# Altium schematic sheet Schematic.SchDoc
size A4
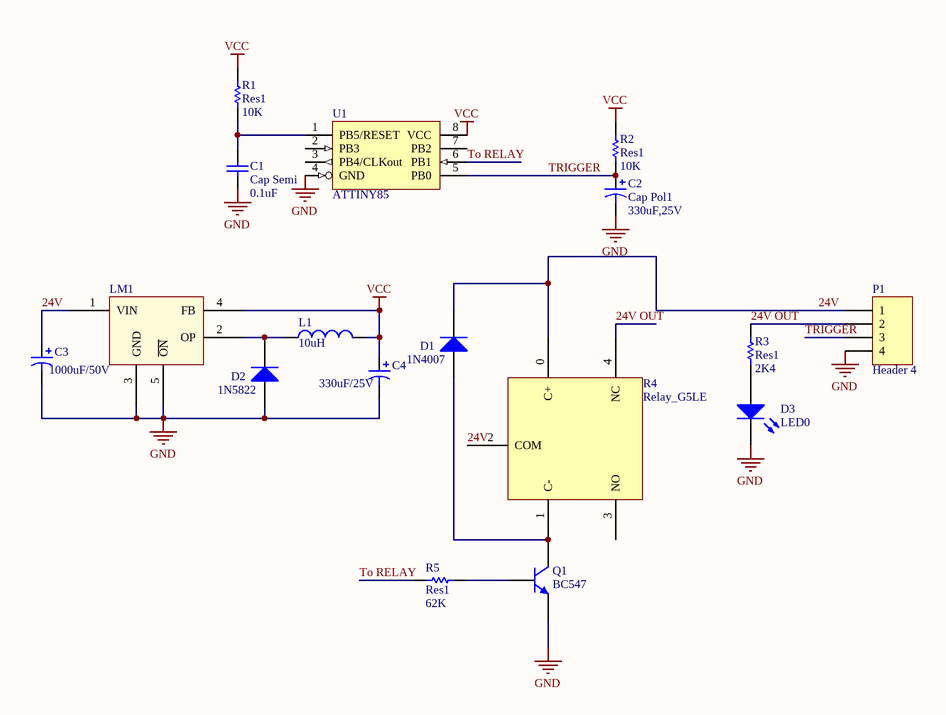
[diagram p0: Schematic.SchDoc]

## Parts
C1  Cap Semi  value 0.1uF  [C1206]
C2  Cap Pol1  value 330uF,25V  [Polar Cap 9 mm]
C3  value 1000uF/50V  [polar Cap]  (hidden comment: Cap Pol1)
C4  value 330uF/25V  [12mm]  (hidden comment: Cap Pol1)
D1  1N4007  [AXIAL-0.4]
D2  1N5822  [AXIAL-0.6]
D3  LED0  [LED]
L1  value 10uH  [WireWound]  (hidden comment: Inductor)
LM1  LM2576  [LM2576]  (value not drawn)
P1  Header 4  [HDR1X4]
Q1  BC547  [TO-92]
R1  Res1  value 10K  [1206]
R2  Res1  value 10K  [1206]
R3  Res1  value 2K4  [1206]
R4  Relay_G5LE  [G5LE_relay]
R5  Res1  value 62K  [1206]
U1  ATTINY85  [DIP8]

## Nets
GND: C1.1 C2.2 C3.2 C4.2 D2.1(A) D3.2(K) LM1.3(GND) LM1.5(~{ON}) P1.4 Q1.1(E) U1.4(GND)
VCC: C4.1 L1.2 LM1.4(FB) R1.2 R2.2 U1.8(VCC)
24V: C3.1 D1.2(K) LM1.1(VIN) P1.1 R4.0(C+) R4.2(COM)
24V OUT: P1.2 R3.2 R4.4(NC)
To RELAY: R5.2 U1.6(PB1)
TRIGGER: C2.1 P1.3 R2.1 U1.5(PB0)
NetC1_2: C1.2 R1.1 U1.1(PB5/RESET)
NetD1_1: D1.1(A) Q1.3(C) R4.1(C-)
NetD2_2: D2.2(K) L1.1 LM1.2(OP)
NetD3_1: D3.1(A) R3.1
NetQ1_2: Q1.2(B) R5.1

Not connected (* = marked no-connect by the designer): R4 3(NO); U1 2(PB3) 3(PB4/CLKout) 7(PB2)

## Library data of the parts
C1 = Cap Semi: Capacitor (Semiconductor SIM Model); Published: 8-Jun-2000; LatestRevisionDate: 29-May-2009; LatestRevisionNote: IPC-7351 Footprint Added.; PackageReference: C1206; Publisher: Altium Limited; PackageDescription: Chip Capacitor
C2-C4 = Cap Pol1: Polarized Capacitor (Radial); Published: 8-Jun-2000; LatestRevisionDate: 17-Jul-2002; LatestRevisionNote: Re-released for DXP Platform.; PackageReference: RB7.6-15; Publisher: Altium Limited; PackageDescription: Polarized Capacitor (Radial); 2 Leads
D1 D2 = Diode 1N5408: 3 Amp Medium Power Silicon Rectifier Diode; Published: 8-Jun-2000; LatestRevisionDate: 17-Jul-2002; LatestRevisionNote: Re-released for DXP Platform.; DatasheetVersion: Aug-1984; PackageReference: DO-201AD; Publisher: Altium Limited; PackageDescription: Diode, Axial; Body 9.5 x 5.3 mm (LxDia. max), Lead Dia. 1.32 mm (max); ComponentLink1Description: Manufacturer Link; ComponentLink1URL: http://www.irf.com/
D3 = LED0: Typical INFRARED GaAs LED; Published: 8-Jun-2000; LatestRevisionDate: 08-Jul-2005; LatestRevisionNote: Mech Layer 1 removed.; PackageReference: LED-0; Publisher: Altium Limited; PackageDescription: LED; 2 Leads
L1 = Inductor: Code_IEC: 1005; Published: 8-Jun-2000; LatestRevisionDate: 29-May-2009; LatestRevisionNote: IPC-7351 Footprint Added.; PackageReference: 0402-A; Publisher: Altium Limited; PackageDescription: Chip Inductor; Code_JEITA: 0402
LM1 = Component_1: Switcher
P1 = Header 4: Header, 4-Pin; LatestRevisionDate: 17-Jul-2002; LatestRevisionNote: Re-released for DXP Platform.; Publisher: Altium Limited
Q1 = 2N3904: NPN General Purpose Amplifier; Published: 8-Jun-2000; LatestRevisionDate: 15-Jan-2003; LatestRevisionNote: PCB Footprint 'BCY-W3/D4.7' replaced; DatasheetVersion: 1997; PackageVersion: Sep-1998; PackageReference: TO-92A; Publisher: Altium Limited; PackageDescription: TO, Flat Index; 3 In-Line, Axial Leads; Body Dia. 4.5mm; Leads 0.51 x 0.48 mm (max); ComponentLink1Description: Manufacturer Link; ComponentLink1URL: http://www.fairchildsemi.com/; ComponentLink2Description: Datasheet; ComponentLink2URL: http://www.fairchildsemi.com/ds/2N%2F2N3904.pdf
R1-R3 R5 = Res1: Resistor; Published: 8-Jun-2000; LatestRevisionDate: 17-Jul-2002; LatestRevisionNote: Re-released for DXP Platform.; PackageReference: AXIAL-0.3; Publisher: Altium Limited; PackageDescription: Axial Device, Thru-Hole; 2 Leads; 0.3 in Pin Spacing
U1 = NE555D: Precision Timer; Published: 16-Jan-2001; LatestRevisionDate: 13-Apr-2006; LatestRevisionNote: IPC-7351 Footprint Added.; DatasheetVersion: Feb-1992; PackageVersion: Jan-1998; PackageReference: D008; Publisher: Altium Limited; PackageDescription: 8-Pin Small Outline Integrated Circuit 1.27 mm Pitch; Code_IPC: SOIC127P600-8; ComponentLink1Description: Manufacturer Link; ComponentLink1URL: http://www.ti.com/; ComponentLink2Description: Datasheet; ComponentLink2URL: http://www-s.ti.com/sc/ds/ne555.pdf